# EAGLE design ESP_L6470 (EAGLE 8.6.0)
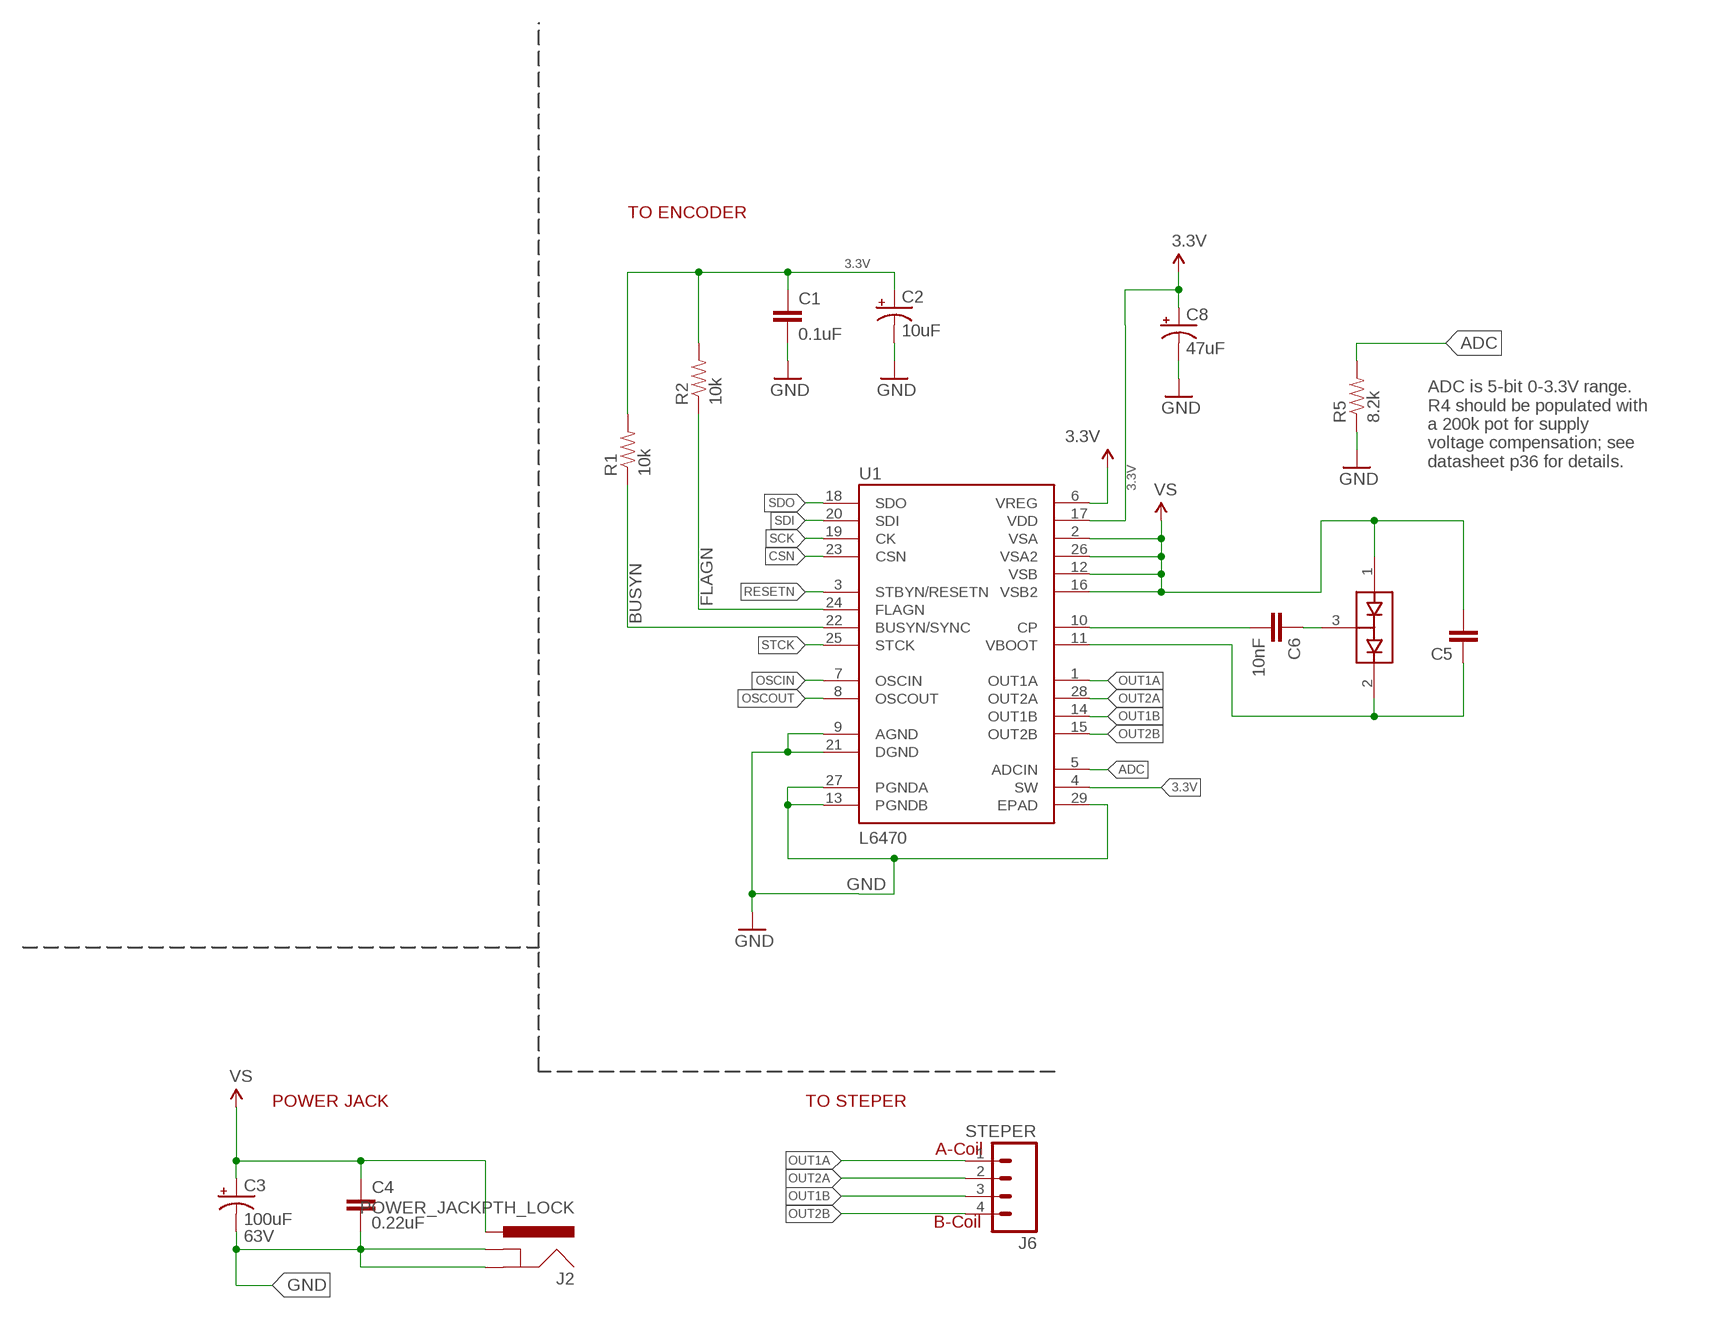
[diagram p0: schematic, sheet 1, part 1 of 2]
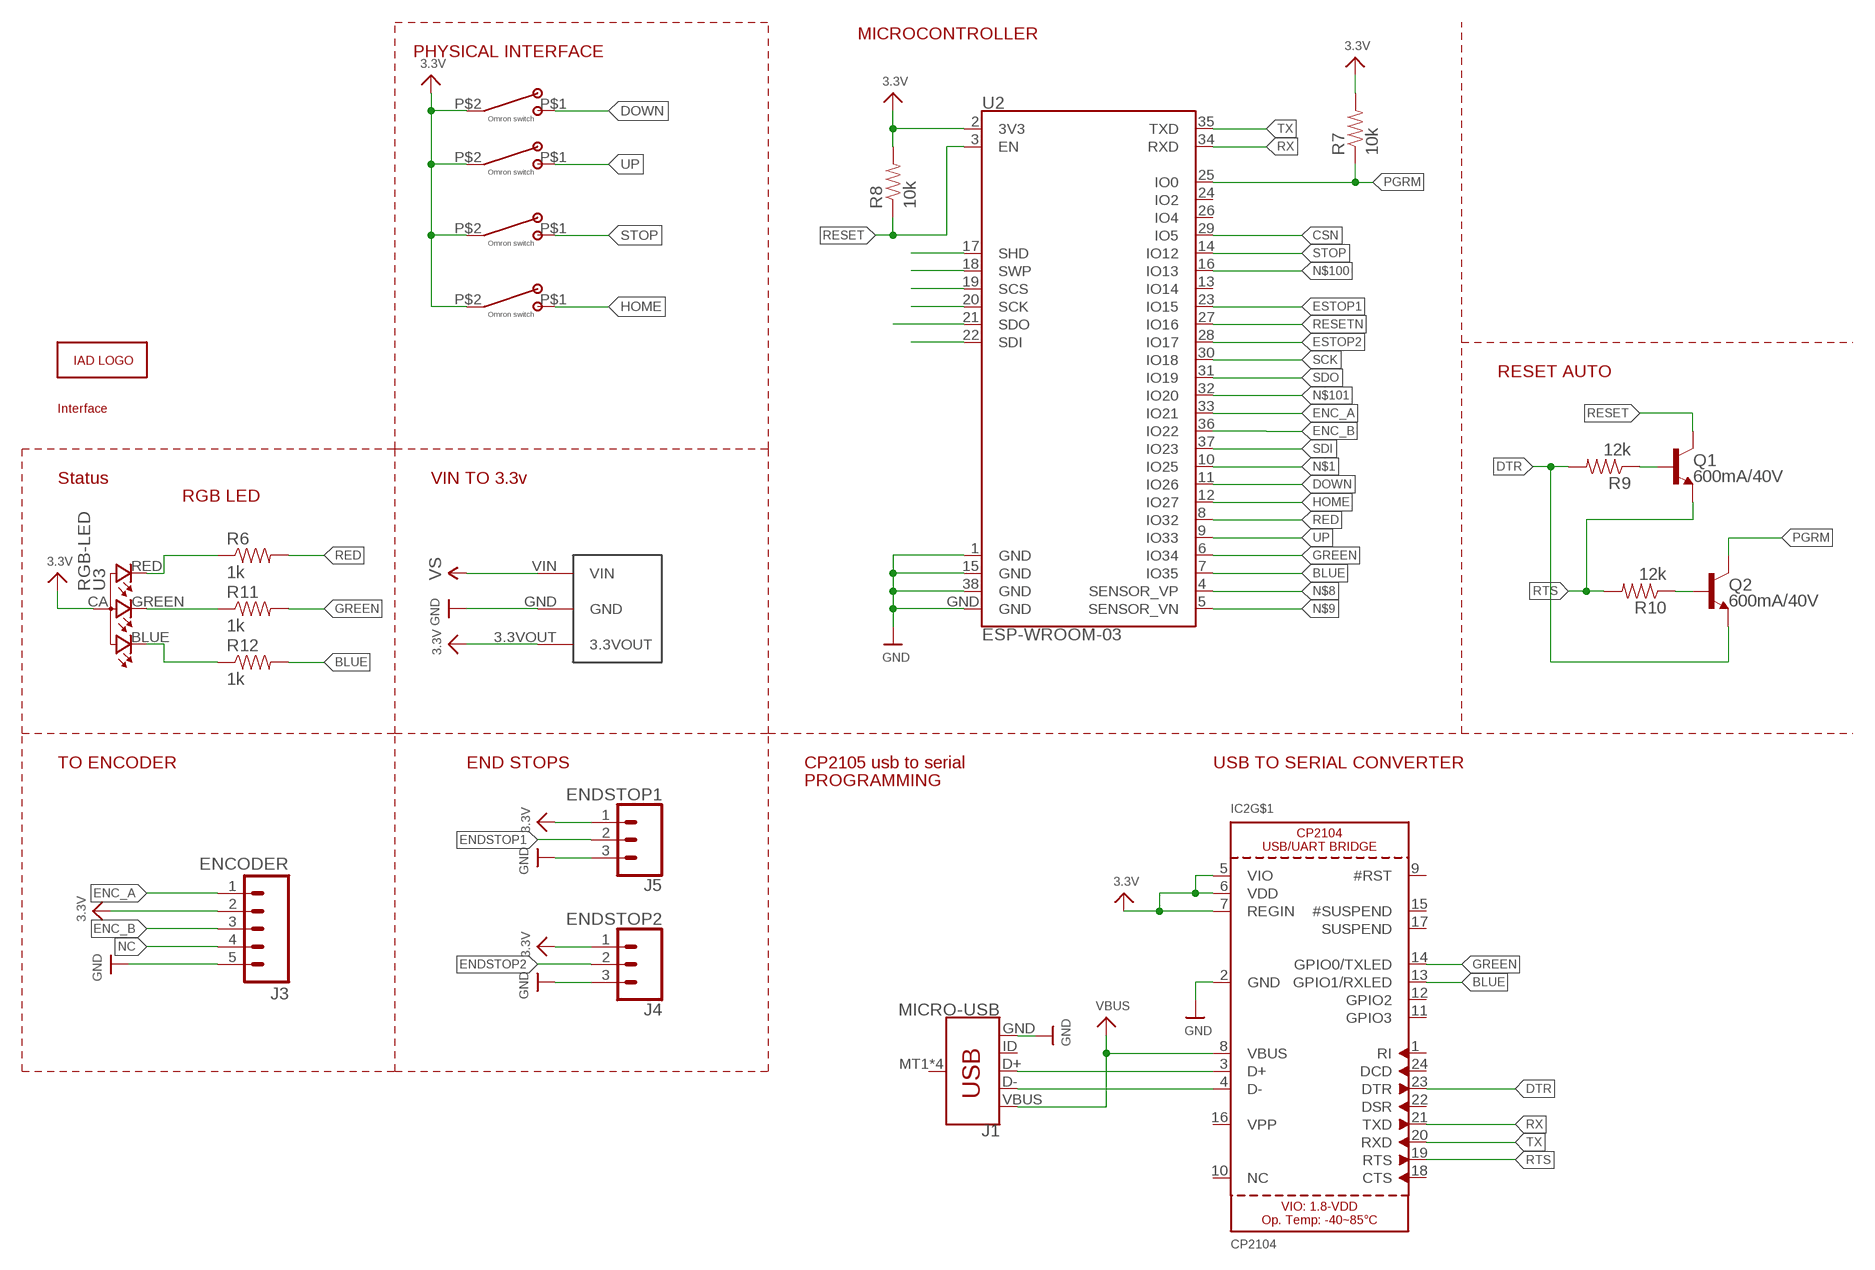
[diagram p1: schematic, sheet 1, part 2 of 2]

## Parts
A1  ZHDK_LOGO_METAL  [ZHDK_LOGO]
A2  INTERFACE_NETSTEPPER  [INTERFACE_NETSTEPPER]
C1  0.1uF  CAP0603-CAP  [0603-CAP]
C2  10uF  10UF-TANT  [EIA3216]
C3  100uF  100UF-63V-20%(ELECT)  [NIC_10X10.5_CAP]
C4  0.22uF  CAP0603-CAP  [0603-CAP]
C5  0.22uF  CAP0603-CAP  [0603-CAP]
C6  10nF  10NF/10000PF-50V-10%(0603)  [0603-CAP]
C8  47uF  47UF-TANT  [EIA3528]
D1  BAV99  [SOT23-3@1]
IC2  CP2104  [QFN24_4MM_SMSC]
J1  MICRO-USB  USB_MICRO-B_SMT  [USB-MICROB]
J2  POWER_JACKPTH_LOCK  [POWER_JACK_PTH_LOCK]
J3  ENCODER  M05PTH  [1X05]
J4  ENDSTOP2  CONN_03  [1X03]
J5  ENDSTOP1  CONN_03  [1X03]
J6  STEPER  M04LOCK_LONGPADS  [1X04_LOCK_LONGPADS]
Q1  600mA/40V  TRANS_NPN-MMBT2222AL  [SOT23-3]
Q2  600mA/40V  TRANS_NPN-MMBT2222AL  [SOT23-3]
R1  10k  RESISTOR0603-RES  [0603-RES]
R2  10k  RESISTOR0603-RES  [0603-RES]
R5  8.2k  RESISTOR0603-RES  [0603-RES]
R6  1k  RESISTOR0603-RES  [0603-RES]
R7  10k  RESISTOR0603-RES  [0603-RES]
R8  10k  RESISTOR0603-RES  [0603-RES]
R9  12k  RESISTOR0603-RES  [0603-RES]
R10  12k  RESISTOR0603-RES  [0603-RES]
R11  1k  RESISTOR0603-RES  [0603-RES]
R12  1k  RESISTOR0603-RES  [0603-RES]
S1  B3AL-1002P-MS  [B3AL-1002P-MS]
S2  B3AL-1002P-MS  [B3AL-1002P-MS]
S3  B3AL-1002P-MS  [B3AL-1002P-MS]
S4  B3AL-1002P-MS  [B3AL-1002P-MS]
U1  L6470  L6470  [HTSSOP28]
U2  ESP-WROOM-03  [ESP-WROOM-03]
U3  RGB-LED  RGB-LED-CLMVB-FKARGB  [PLCC4-2MM-RGB]
U4  TRACO12433  [TRACO12433]

## Nets
3.3V: C1.1 C2.A(+) C8.A(+) IC2.5(VIO) IC2.6(VDD) IC2.7(REGIN) J3.2 J4.1 J5.1 R1.2 R2.2 R7.2 R8.2 S1.P$2 S2.P$2 S3.P$2 S4.P$2 U1.4(SW) U1.6(VREG) U1.17(VDD) U2.2(3V3) U3.CA U4.3.3VOUT
ADC: R5.2 U1.5(ADCIN)
BLUE: IC2.13(GPIO1/RXLED) R12.2 U2.7(IO35)
BUSYN: R1.1 U1.22(BUSYN/SYNC)
CP_HIGH: C6.1 D1.3(COM)
CSN: U1.23(CSN) U2.29(IO5)
DOWN: S1.P$1 U2.11(IO26)
DTR: IC2.23(DTR) Q2.2(E) R9.2
ENC_A: J3.1 U2.33(IO21)
ENC_B: J3.3 U2.36(IO22)
ENDSTOP1: J5.2
ENDSTOP2: J4.2
ESTOP1: U2.23(IO15)
ESTOP2: U2.28(IO17)
FLAGN: R2.1 U1.24(FLAGN)
GND: C1.2 C2.C(-) C3.- C4.2 C8.C(-) IC2.2(GND) J1.GND J2.GND J2.GNDBREAK J3.5 J4.3 J5.3 R5.1 U1.9(AGND) U1.13(PGNDB) U1.21(DGND) U1.27(PGNDA) U1.29(EPAD) U2.1(GND) U2.15(GND) U2.38(GND) U2.GND U4.GND
GREEN: IC2.14(GPIO0/TXLED) R11.2 U2.6(IO34)
HOME: S4.P$1 U2.12(IO27)
N$1: U2.10(IO25)
N$2: U2.17(SHD)
N$3: U2.18(SWP)
N$4: U2.19(SCS)
N$5: U2.20(SCK)
N$6: U2.21(SDO)
N$8: U2.4(SENSOR_VP)
N$9: U2.5(SENSOR_VN)
N$10: U2.22(SDI)
N$11: R11.1 U3.GREEN
N$12: R6.1 U3.RED
N$13: IC2.3(D+) J1.D+
N$14: IC2.4(D-) J1.D-
N$20: R12.1 U3.BLUE
N$22: Q1.1(B) R9.1
N$23: Q2.1(B) R10.1
N$100: U2.16(IO13)
N$101: U2.32(IO20)
NC: J3.4
OSCIN: U1.7(OSCIN)
OSCOUT: U1.8(OSCOUT)
OUT1A: J6.1 U1.1(OUT1A)
OUT1B: J6.3 U1.14(OUT1B)
OUT2A: J6.2 U1.28(OUT2A)
OUT2B: J6.4 U1.15(OUT2B)
PGRM: Q2.3(C) R7.1 U2.25(IO0)
RED: R6.2 U2.8(IO32)
RESET: Q1.3(C) R8.1 U2.3(EN)
RESETN: U1.3(STBYN/RESETN) U2.27(IO16)
RTS: IC2.19(RTS) Q1.2(E) R10.2
RX: IC2.21(TXD) U2.34(RXD)
SCK: U1.19(CK) U2.30(IO18)
SDI: U1.20(SDI) U2.37(IO23)
SDO: U1.18(SDO) U2.31(IO19)
STCK: U1.25(STCK)
STOP: S3.P$1 U2.14(IO12)
TX: IC2.20(RXD) U2.35(TXD)
UP: S2.P$1 U2.9(IO33)
V_BOOT: C5.1 D1.2(C2) U1.11(VBOOT)
V_CP: C6.2 U1.10(CP)
VBUS: IC2.8(VBUS) J1.VBUS
VS: C3.+ C4.1 C5.2 D1.1(A1) J2.PWR U1.2(VSA) U1.12(VSB) U1.16(VSB2) U1.26(VSA2) U4.VIN
Unconnected: IC2.1(RI) IC2.9(#RST) IC2.10(NC) IC2.11(GPIO3) IC2.12(GPIO2) IC2.15(#SUSPEND) IC2.16(VPP) IC2.17(SUSPEND) IC2.18(CTS) IC2.22(DSR) IC2.24(DCD) J1.ID J1.MT1(SHIELD) J1.MT2(SHIELD) J1.P$1(SHIELD) J1.P$2(SHIELD) U2.13(IO14) U2.24(IO2) U2.26(IO4)

## Notes on the sheet
- MICROCONTROLLER
- PHYSICAL INTERFACE
- TO ENCODER
- RESET AUTO
- ADC is 5-bit 0-3.3V range.
  R4 should be populated with
  a 200k pot for supply
  voltage compensation; see
  datasheet p36 for details.
- Status | VIN TO 3.3v
- RGB LED
- TO ENCODER | END STOPS | CP2105 usb to serial | USB TO SERIAL CONVERTER
- PROGRAMMING
- POWER JACK | TO STEPER
- A-Coil
- B-Coil
- 63V

## Power pins joined to a net without a drawn wire
TP: IC2.THERM(TP)

## Library data of the parts
A1 = IAD_GRAPHIC:ZHDK_LOGO_METAL
A2 = IAD_GRAPHIC:INTERFACE_NETSTEPPER
C1 C4 C5 = SparkFun-Passives:CAP: Capacitor Standard 0603 ceramic capacitor, and 0.1" leaded capacitor.
C2 = SparkFun-Capacitors:10UF-TANT: 10uF Tantalum SMT CAP-00811- 16V 10% (EIA-3216); PROD_ID: CAP-00811
C3 = SparkFun-Capacitors:100UF-63V-20%(ELECT): CAP-08362 100uF electrolytic SMT 63V 20%; PROD_ID: CAP-08362
C6 = SparkFun-Capacitors:10NF/10000PF-50V-10%(0603): CAP-00867; PROD_ID: CAP-00867
C8 = SparkFun-Capacitors:47UF-TANT: 47uF Tantalum SMT CAP-08310- 10V 10% (EIA-3528); PROD_ID: CAP-08310
D1 = SparkFun-DiscreteSemi:BAV99: Two small signal silicon diodes connected anode to cathode. Connections to all three nodes available. DIO-10647; PROD_ID: DIO-10647
IC2 = microbuilder:CP2104: CP2104 - USB to UART Bridge VDD Output: 3.45V
J1 = SparkFun-Connectors:USB_MICRO-B: USB Type Micro-B Connector Male/female and PTH/SMT variants SparkFun Products: SparkFun microB USB Breakout <https://www.sparkfun.com/products/12035> SparkFun USB microB Plug Breakout <https://www.sparkfun.com/products/10031> SparkFun ESP8266 Thing <https://www.sparkfun.com/products/13231>; PROD_ID: CONN-09505; SF_ID: PRT-08533
J2 = SparkFun-Connectors:POWER_JACK: Power Jack This is the standard 5.5mm barrel jack for power. The PTH is the most common, proven, reliable, footprint. The Slot footprint only works if the mill layer is transmitted to the PCB fab house so be warned. Mating wall wart : TOL-00298 (and others); PROD_ID: CONN-08197; SF_ID: PRT-00119
J3 = SparkFun-Connectors:M05: Header 5 Standard 5-pin 0.1" header. Use with straight break away headers (SKU : PRT-00116), right angle break away headers (PRT-00553), swiss pins (PRT-00743), machine pins (PRT-00117), and female headers (PRT-00115). Molex polarized connector foot print use with SKU : PRT-08230 with associated crimp pins and housings.
J4 J5 = SparkFun-Connectors:CONN_03: Multi connection point. Often used as Generic Header-pin footprint for 0.1 inch spaced/style header connections On any of the 0.1 inch spaced packages, you can populate with these: Break Away Headers - Straight <https://www.sparkfun.com/products/116> (PRT-00116) Break Away Male Headers - Right Angle <https://www.sparkfun.com/products/553> (PRT-00553) Female Headers <https://www.sparkfun.com/products/115> (PRT-00115) Break Away Headers - Machine Pin <https://www.sparkfun.com/products/117> (PRT-00117) Break Away Female Headers - Swiss Machine Pin <https://www.sparkfun.com/products/743> (PRT-00743) Stackable Header - 3 Pin (Female, 0.1") <https://www.sparkfun.com/products/13875> (PRT-13875) For SCREWTERMINALS and SPRING TERMINALS visit here: Screw Terimnals on SparkFun.com <https://www.sparkfun.com/search/results?term=Screw+Terminals> (5mm/3.5mm/2.54mm spacing) This device is also useful as a general connection point to wire up your design to another part of your project. Our various solder wires solder well into these plated through hole pads. Hook-Up Wire - Assortment (Stranded, 22 AWG) <https://www.sparkfun.com/products/11375> (PRT-11375) Hook-Up Wire - Assortment (Solid Core, 22 AWG) <https://www.sparkfun.com/products/11367> (PRT-11367) View the entire wire category on our website here <https://www.sparkfun.com/categories/141> Special notes: Molex polarized connector foot print use with SKU : PRT-08232 with associated crimp pins and housings.
J6 = SparkFun-Connectors:M04: Header 4 Standard 4-pin 0.1" header. Use with straight break away headers (SKU : PRT-00116), right angle break away headers (PRT-00553), swiss pins (PRT-00743), machine pins (PRT-00117), and female headers (PRT-00115). Molex polarized connector foot print use with SKU : PRT-08231 with associated crimp pins and housings. 1MM SMD Version SKU: PRT-10208; PROD_ID: CONN-09696
Q1 Q2 = SparkFun-DiscreteSemi:TRANS_NPN: NPN transistor Current controlled devices typically used to amplify current or used as a switch. BC547 - COM-08928 <http://www.sparkfun.com/products/8928> (TO-92 45V 100mA) (1.Collector 2.Base 3.Emitter) 2N3904 - COM-00521 <http://www.sparkfun.com/products/521> (TO-92 40V 200mA) (1.Emitter 2.Base 3.Collector) P2N2222A - COM-12852 <http://www.sparkfun.com/products/12852> (TO-92 40V 600mA) (1.Collector 2.Base 3.Emitter); PROD_ID: TRANS-08049
R1 R2 R5-R12 = SparkFun-Passives:RESISTOR: Resistor Basic schematic elements and footprints for 0603, 1206, and PTH resistors.
S1-S4 = IAD-Library:B3AL-1002P-MS
U1 = SparkFun-PowerIC:L6470: 3A RMS/7A peak bipolar stepper motor driver with SPI control and step input in HTSSOP-28 package. IC-10648; PROD_ID: IC-10648
U2 = esp32:ESP-WROOM-03
U3 = Particle:RGB-LED-CLMVB-FKA: CREE CLMVB-FKA RGB LED 2mm x 2mm
U4 = IAD_ZHDK:TRACO12433

## Board
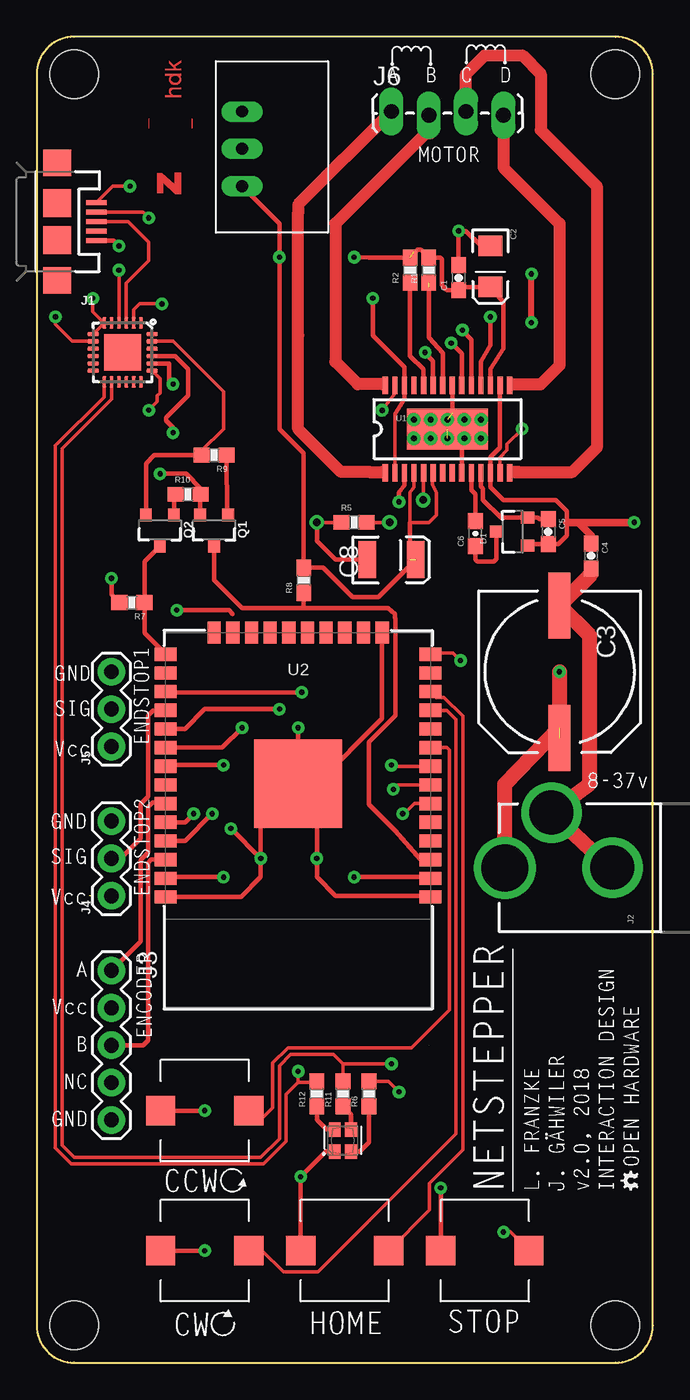
[diagram p2: board, top side]
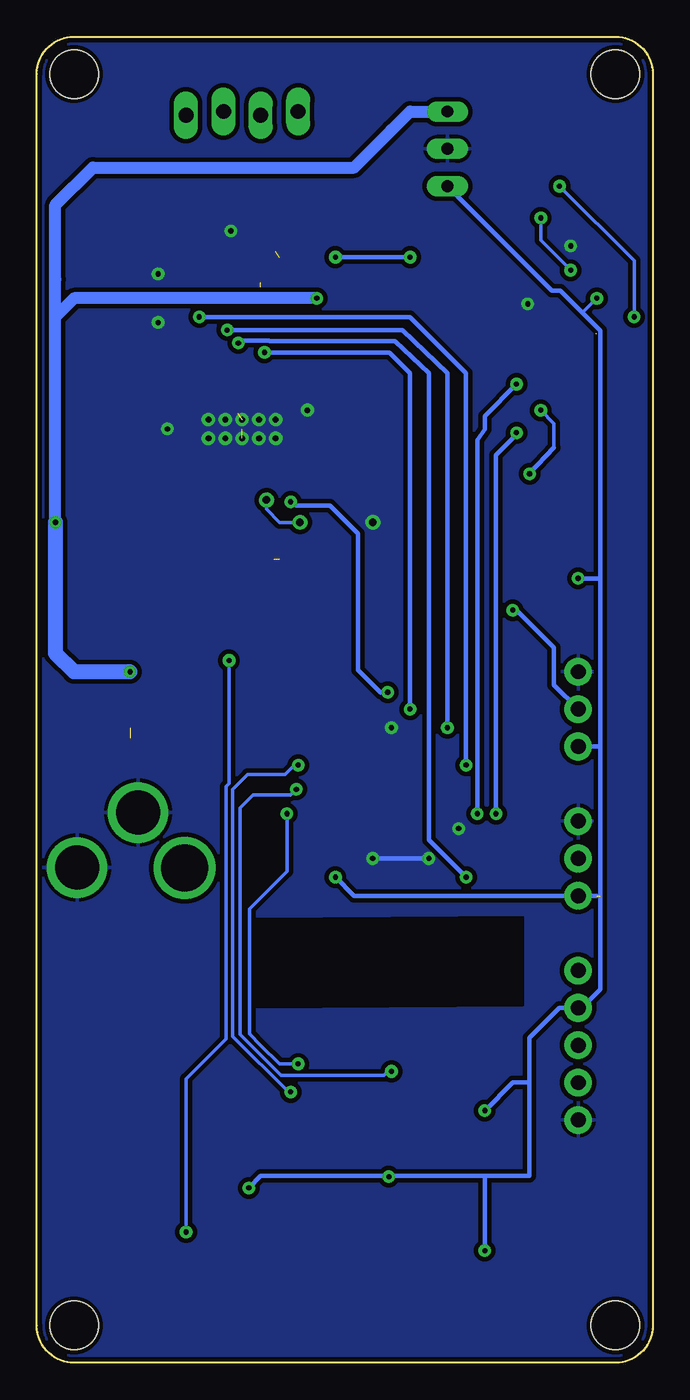
[diagram p3: board, bottom side, seen from below]

Size 41.91 x 90.17 mm. Coordinates in mm from the lower left corner, seen from the top.
Outline: 41.91,2.54 41.91,87.63 arc90 39.37,90.17 2.54,90.17 arc90 0,87.63 0,2.54 arc90 2.54,0 39.37,0 arc90 41.91,2.54
Copper layers (1*16): Top 0.035mm / dielectric 1.5mm / Bottom 0.035mm
Design rules "SparkFun *": minimum track width 8mil, minimum drill 20mil, track to track 8mil, track to pad 12mil, pad to pad 8mil, via to via 16mil, smd to smd 8mil, copper to edge 10mil, drill to drill 8mil, minimum pad ring 12mil, minimum via ring 10mil, stop-mask expansion 4mil, vias tented up to drill 25mil, thermal gap 10mil

### Footprints (pad centres in the part's own frame; a part is rotated, then mirrored left to right if it is on the bottom)
0603-CAP = smd 1.1 x 1: 1 -0.85,0; 2 0.85,0
EIA3216 = smd 1.4 x 1.6: A 1.4,0; C -1.4,0
NIC_10X10.5_CAP = smd 4.5 x 1.5: + 4.5,0; - -4.5,0
EIA3528 = smd 1.2 x 2.5: A 1.65,0; C -1.65,0
SOT23-3@1 = smd 0.8 x 0.9: 1 -0.95,-1; 2 0.95,-1; 3 0,1.1
QFN24_4MM_SMSC = smd 0.8 x 0.28: 1 -2,1.25; 2 -2,0.75; 3 -2,0.25; 4 -2,-0.25; 5 -2,-0.75; 6 -2,-1.25; 13 2,-1.25; 14 2,-0.75; 15 2,-0.25; 16 2,0.25; 17 2,0.75; 18 2,1.25 | smd 0.28 x 0.8: 7 -1.25,-2; 8 -0.75,-2; 9 -0.25,-2; 10 0.25,-2; 11 0.75,-2; 12 1.25,-2; 19 1.25,2; 20 0.75,2; 21 0.25,2; 22 -0.25,2; 23 -0.75,2; 24 -1.25,2 | smd 2.5 x 2.5: THERM 0,0
USB-MICROB = smd 1.4 x 0.35: D+ -2.65,0; D- -2.65,-0.65; GND -2.65,1.3; ID -2.65,0.65; VBUS -2.65,-1.3 | smd 1.9 x 1.8: MT1 0,-4; MT2 0,4 | smd 1.9 x 1.9: P$1 0,-1.27; P$2 0,1.27
POWER_JACK_PTH_LOCK = drill 2.997 pad 4.115: GND 0.025,6.557; GNDBREAK 3.762,10.7 | drill 3.2 pad 4.115: PWR 0,13.878
1X05 = drill 1.016 pad 1.88: 1 0,0; 2 2.54,0; 3 5.08,0; 4 7.62,0; 5 10.16,0
1X03 = drill 1.016 pad 1.88: 1 0,0; 2 2.54,0; 3 5.08,0
1X04_LOCK_LONGPADS = drill 1.016 long: 1 0,0; 2 2.54,-0.254; 3 5.08,0; 4 7.62,-0.254
SOT23-3 = smd 0.8 x 0.9: 1 -0.95,-1; 2 0.95,-1; 3 0,1.1
0603-RES = smd 1.1 x 1: 1 -0.85,0; 2 0.85,0
B3AL-1002P-MS = smd 2 x 2: P$1 -3,0; P$2 3,0
HTSSOP28 = smd 0.36 x 1.19: 1 -4.225,-2.97; 2 -3.575,-2.97; 3 -2.925,-2.97; 4 -2.275,-2.97; 5 -1.625,-2.97; 6 -0.975,-2.97; 7 -0.325,-2.97; 8 0.325,-2.97; 9 0.975,-2.97; 10 1.625,-2.97; 11 2.275,-2.97; 12 2.925,-2.97; 13 3.575,-2.97; 14 4.225,-2.97; 15 4.225,2.97; 16 3.575,2.97; 17 2.925,2.97; 18 2.275,2.97; 19 1.625,2.97; 20 0.975,2.97; 21 0.325,2.97; 22 -0.325,2.97; 23 -0.975,2.97; 24 -1.625,2.97; 25 -2.275,2.97; 26 -2.925,2.97; 27 -3.575,2.97; 28 -4.225,2.97 | smd 5.5 x 2.8: 29 0,0
ESP-WROOM-03 = smd 0.9 x 1.5: 1 7.7,9; 2 6.43,9; 3 5.16,9; 4 3.89,9; 5 2.62,9; 6 1.35,9; 7 0.08,9; 8 -1.19,9; 9 -2.46,9; 10 -3.73,9; 11 -5,9; 12 -6.27,9; 13 -7.54,9; 14 -8.81,9; 25 -8.81,-9; 26 -7.54,-9; 27 -6.27,-9; 28 -5,-9; 29 -3.73,-9; 30 -2.46,-9; 31 -1.19,-9; 32 0.08,-9; 33 1.35,-9; 34 2.62,-9; 35 3.89,-9; 36 5.16,-9; 37 6.43,-9; 38 7.7,-9 | smd 1.5 x 0.9: 15 -10.3,5.715; 16 -10.3,4.445; 17 -10.3,3.175; 18 -10.3,1.905; 19 -10.3,0.635; 20 -10.3,-0.635; 21 -10.3,-1.905; 22 -10.3,-3.175; 23 -10.3,-4.445; 24 -10.3,-5.715 | smd 6 x 6: GND 0,0
PLCC4-2MM-RGB = smd 1 x 0.8: BLUE -0.75,-0.55; CA 0.75,-0.55; GREEN -0.75,0.55; RED 0.75,0.55
TRACO12433 = drill 0.8 long: 3.3VOUT 0,-2.54; GND 0,0; VIN 0,2.54
STAND-OFF = hole 3.302: 0,0

### Placement (x,y rotation side)
A1  7.62,78.74 90 top
A2  2.54,2.54 0 top
C1  28.7,73.79 90 top
C2  30.86,74.55 270 top
C3  35.56,46.99 270 top
C4  37.72,54.86 270 top
C5  34.8,56.52 270 top
C6  29.84,56.39 90 top
C8  24.13,54.61 0 top
D1  32.38,56.52 90 top
IC2  5.84,68.71 270 top
J1  1.4,77.6 180 top
J2  45.72,33.66 90 top
J3  5.08,26.67 270 top
J4  5.08,31.75 90 top
J5  5.08,41.91 90 top
J6  24.13,85.09 0 top
Q1  12.07,56.64 180 top
Q2  8.38,56.64 180 top
R1  26.67,74.29 90 top
R2  25.4,74.29 90 top
R5  21.59,57.15 0 top
R6  22.61,18.29 90 top
R7  6.48,51.69 180 top
R8  18.16,53.21 90 top
R9  12.07,61.72 180 top
R10  10.29,59.05 0 top
R11  20.83,18.29 90 top
R12  19.05,18.29 90 top
S1  11.43,7.62 180 top
S2  11.43,17.14 180 top
S3  30.48,7.62 180 top
S4  20.96,7.62 180 top
U1  27.94,63.5 0 top
U2  17.78,39.37 270 top
U3  20.83,15.11 270 top
U4  13.97,82.55 0 top
U$9  [STAND-OFF]  2.54,2.54 0 top
U$10  [STAND-OFF]  39.37,2.54 0 top
U$11  [STAND-OFF]  39.37,87.63 0 top
U$12  [STAND-OFF]  2.54,87.63 0 top

### Tracks (layer width: path | path; a pad name or v marks a point on that pad's centre or on a via)
3.3V  (via drill 0.35)  (4 unrouted)
  Top 0.254: U1.4 25.66,59.95 25.65,59.56 25.4,59.18 25.4,57.15 26.67,57.15 27.18,57.66 27.18,59.18 26.92,59.73 U1.6 | C2.A | 28.91,73.15 C1.1 | IC2.5 IC2.6 | IC2.6 3.91,70.03 3.84,70.03 | IC2.6 3.81,71.49 v3.81,72.39
  Top 0.305: U1.17 30.86,67.56 31.75,68.96 31.75,72.14 C2.A | C2.A 28.91,73.15 | C1.1 27.9,72.94 27.56,73.28 27.56,75.06 27.47,75.14 R1.2 26.12,75.69 25.91,75.69 25.78,75.56 25.65,75.56 | 25.4,57.15 25.4,54.61 | U4.3.3VOUT 16.51,77.47 v16.51,75.18 16.51,63.5 18.16,61.85 R8.2 19.47,54.06 21.46,52.07 23.24,52.07 C8.A | R2.2 22.57,75.14 v21.59,75.18 | S3.P$2 v27.48,11.89 | S4.P$2 v17.96,12.65 19.67,14.36 U3.CA 20.32,14.32 | U2.2 26.7,33.02 v21.59,33.02 | R7.2 5.08,52.24 v5.08,53.34 | S1.P$2 v11.43,7.62 | S2.P$2 v11.43,17.14
  Bottom 0.254: v3.81,72.39 4.78,71.42 | 19.05,12.7 18,12.7 v17.96,12.65
  Bottom 0.305: v21.59,75.18 v16.51,75.18 | J5.1 3.56,41.91 | 3.56,41.91 3.56,31.75 3.56,25.4 4.83,24.13 J3.2 6.35,24.13 8.38,22.1 8.38,19.05 | 3.81,31.75 J4.1 6.35,31.75 20.32,31.75 v21.59,33.02 | 3.56,41.91 3.56,48.77 3.56,53.34 | 3.56,53.34 3.56,54.61 3.56,58.42 3.56,63.5 3.56,70.2 4.78,71.42 6.28,72.92 6.88,72.92 U4.3.3VOUT | v27.48,11.89 26.67,12.7 19.05,12.7 11.43,12.7 | 11.43,12.7 8.38,12.7 8.38,16.51 8.38,19.05 | v5.08,53.34 3.56,53.34 | v11.43,7.62 11.43,12.7 | v11.43,17.14 9.53,19.05 8.38,19.05
ADC  (via drill 0.51)
  Top 0.254: U1.5 26.29,60.5 26.29,58.8 v26.29,58.67 | v24,57.15 23.37,57.15 R5.2
  Bottom 0.254: v26.29,58.67 26.29,58.04 25.4,57.15 v24,57.15
BLUE  (via drill 0.35)
  Top 0.254: IC2.13 4.59,65.68 1.27,62.36 1.27,14.61 1.51,14.35 2.35,13.51 15.43,13.51 16.97,15.05 16.97,18.24 17.78,19.05 | 17.78,19.05 18.96,19.05 R12.2 | U2.7 24.56,39.29 v24.26,38.99 | v17.78,19.81 17.78,19.05
  Bottom 0.254: v24.26,38.99 24.64,38.61 27.18,38.61 28.07,37.72 28.07,22.34 25.29,19.56 18.29,19.56 17.78,20.07 v17.78,19.81
BUSYN  (1 unrouted)
  Top 0.203: 26.67,73.15 26.67,73.02
  Top 0.305: U1.22 27.62,68.65 26.67,69.72 26.67,71.12 26.67,73.15
CP_HIGH
  Top 0.305: D1.3 31.29,54.65 31.11,54.48 29.97,54.48 29.84,54.61 C6.1
CSN  (via drill 0.35)
  Top 0.305: U1.23 26.96,68.11 v26.42,68.71 | U2.29 10.08,43.1 11.43,44.45 v16.51,44.45
  Bottom 0.305: v26.42,68.71 17.91,68.71 16.51,67.31 v16.51,44.45
DOWN
  Top 0.254: U2.11 27.89,44.37 28.52,43.74 28.52,15.58 19.13,6.19 16.78,6.19 15.34,7.62 S1.P$1
  Top 0.305: U2.11 26.86,44.45
DTR
  Top 0.254: IC2.23 9.28,69.46 12.7,66.04 12.7,63.5 11.21,62.02 R9.2
  Top 0.305: R9.2 8,61.72 7.43,61.15 Q2.2
ENC_A
  Top 0.305: J3.1 7.07,28.66 7.07,34.2 7.57,34.71 7.57,37.8 7.87,38.1 8.7,38.1 U2.33
ENC_B
  Top 0.305: U2.36 7.79,34.21 7.57,33.99 7.57,21.92 7.24,21.59 J3.3
ENDSTOP1  (via drill 0.35)
  Top 0.305: 13.34,50.93 13.08,51.18 10.16,51.18 v9.53,51.18
  Bottom 0.305: v9.53,51.18 9.27,51.18 6.73,48.64 6.73,46.1 J5.2
ENDSTOP2
  Top 0.305: 5.16,34.21 J4.2 5.71,34.29 7.07,35.64 7.07,38.01 7.57,38.52 7.57,44.02 7.92,44.37
FLAGN
  Top 0.152: 26.29,66.5 U1.24
  Top 0.305: R2.1 25.4,72.14 25.4,68.45 26.29,67.56 26.29,66.5
GND  (via drill 0.35, 0.38, 0.4, 0.51)  (2 unrouted)
  Top 0.254: R5.1 v19.05,57.15 | U1.27 24.37,65.89 v23.5,64.77 | IC2.2 6.59,71.62 6.99,72.01 v8.51,72.01 | U1.13 31.51,61.57 32,62.05 32,62.48 v33.02,63.5 | 30.6,75.69 C2.C 30.6,75.69
  Top 0.305: U2.1 26.7,31.75 20.32,31.75 19.05,33.02 v19.05,34.29 19.05,36.83 | U2.38 13.89,31.67 15.24,33.02 v15.24,34.29 | v15.24,34.29 15.24,39.37 | v17.78,43.18 U2.GND 19.05,39.37 23.5,43.81 U2.15 | C8.C 20.32,54.61 19.05,55.88 v19.05,57.15 | C2.C 30.22,75.95 29.21,76.96 v28.7,76.96 28.7,76.2 C1.2 | U1.21 28.27,64.59 | U1.9 28.91,62.82 v29.08,62.87 | J1.GND 5.24,76.3 v5.59,75.95 | v15.24,34.29 v13.21,36.32
  Top 0.406: v33.65,70.74 v33.65,74.04
  Top 1.016: J2.GND 38.76,33.93 J2.GNDBREAK 37.61,39.37 37.61,49.44 C3.- 37.72,53.65 C4.2
  Bottom 0.305: v15.24,34.29 v19.05,34.29
  other vias: 25.65,62.87 25.65,64.13 26.8,62.87 26.8,64.13 27.94,62.87 30.23,64.13 30.23,62.87 29.08,64.13 27.94,64.13
  pour Bottom (isolate 0.305, rank 3): -1.27,-1.27 8.64,-1.27 8.64,30.48 27.05,30.35 27.05,24 8.76,24.13 8.89,-1.27 43.18,-1.27 43.18,91.44 -1.27,91.44
  pour Bottom (isolate 0.305): 34.29,59.69 21.59,59.69 21.59,67.31 34.29,67.31
GREEN  (via drill 0.35)  (1 unrouted)
  Top 0.254: IC2.14 5.08,66.69 5.08,65.52 1.73,62.17 1.73,15.24 1.73,14.78 2.54,13.97 15.24,13.97 16.51,15.24 16.51,20.19 17.27,20.96 20.19,20.96 20.83,20.32 | R11.2 20.83,20.32 | U2.6 25.7,38.02 24.89,37.21 v24.89,37.34 | v24.13,20.32 20.83,20.32
  Bottom 0.254: v24.89,37.34 24.89,33.4 27.43,30.86 27.43,22.35 26.67,21.59 25.4,20.32 v24.13,20.32
HOME
  Top 0.254: U2.12 27.17,45.25 27.71,45.25 28.98,43.98 28.98,14.46 26.72,12.2 26.72,10.39 S4.P$1
N$11
  Top 0.305: R11.1 21.38,16.89 U3.GREEN
N$12
  Top 0.305: R6.1 22.61,14.99 21.97,14.35 21.96,14.36 U3.RED
N$13
  Top 0.254: IC2.3 6.09,73.4 7.62,74.93 7.62,76.2 6.22,77.6 J1.D+
N$14  (via drill 0.35)
  Top 0.254: IC2.4 5.59,74.16 5.59,74.17 v5.59,74.29 | J1.D- 7.22,78.25 v7.62,77.85
  Bottom 0.254: v5.59,74.29 7.62,76.33 v7.62,77.85
N$20
  Top 0.305: R12.1 19.05,16.51 19.7,15.86 U3.BLUE
N$22
  Top 0.305: R9.1 12.96,57.69 Q1.1
N$23
  Top 0.305: Q2.1 9.33,59
  Top 0.406: 9.33,59 R10.1
OUT1A
  Top 0.254: 22.66,60.53 22.61,60.58
  Top 0.305: 23.5,60.58 23.54,60.66 U1.1
  Top 0.813: J6.1 17.78,78.74 17.78,78.23 17.78,69.85 17.78,63.5 20.7,60.58 22.61,60.58 23.5,60.58
OUT1B
  Top 0.305: U1.14 32.47,60.58
  Top 0.508: 32.47,60.58 32.77,60.58
  Top 0.813: J6.3 29.21,87.63 30.48,88.9 33.02,88.9 34.29,87.63 34.29,83.82 35.56,82.55 38.1,80.01 38.1,62.23 36.45,60.58 32.47,60.58 32.77,60.58
OUT2A
  Top 0.305: U1.28 23.64,66.55 23.5,66.55
  Top 0.813: 26.67,83.82 20.32,77.47 20.32,68.07 21.84,66.55 23.5,66.55
  Top 1.27: J6.2 26.67,83.82
OUT2B
  Top 0.305: U1.15 32.37,66.55
  Top 0.813: J6.4 31.75,81.28 35.56,77.47 35.56,67.82 34.29,66.55 32.77,66.55 32.37,66.55
PGRM
  Top 0.305: U2.25 7.33,49.63 R7.1 7.33,54.49 Q2.3
RED  (via drill 0.35)
  Top 0.254: U2.8 24.43,40.56 24.38,40.51 24.26,40.64 v24.13,40.64 | v24.64,18.41 23.91,19.14 R6.2
  Top 0.305: U2.8 26.7,40.64
  Bottom 0.254: v24.13,40.64 24.38,40.64 25.02,40.01 27.56,40.01 28.57,38.99 28.57,22.2 24.79,18.41 v24.64,18.41
RESET
  Top 0.305: 18.16,51.31 13.97,51.31 12.07,53.21 Q1.3 | 18.16,51.31 23.88,51.31 24.38,50.93 24.38,50.63 24.4,50.61 24.4,44 22.61,42.21 22.61,37.97 24.38,36.2 26.12,34.21 U2.3 | 18.16,51.31 R8.1
RESETN  (via drill 0.35)
  Top 0.305: U1.3 25.02,59.94 25.02,59.69 24.64,59.18 v24.64,58.55 | U2.27 8.89,45.64 | 8.89,45.64 9.1,45.64 | v18.03,45.59 8.94,45.59 8.89,45.64
  Bottom 0.305: v24.64,58.55 24.26,58.29 21.97,58.29 20.07,56.39 20.07,47.12 18.54,45.59 v18.03,45.59
RTS  (via drill 0.35)
  Top 0.254: IC2.19 8.38,66.92 8.38,65.95 8.2,65.77 8.2,65.35 v7.62,64.77
  Top 0.305: 11.12,58.98 Q1.2 | R10.2 11.19,59.43 10.16,60.45 v8.38,60.45
  Top 0.406: R10.2 11.12,58.98
  Bottom 0.254: 6.73,62.23 6.73,63.88 v7.62,64.77
  Bottom 0.305: v8.38,60.45 6.73,62.23
RX  (via drill 0.35)
  Top 0.305: U2.34 10.08,36.75 v10.67,37.34 | v9.27,63.25 9.27,63.58 8.79,64.06 8.79,64.26 10.29,65.76 10.29,67.56 9.4,68.45 8.49,68.45 | 8.49,68.45 8.49,68.46 | IC2.21 8.49,68.45
  Bottom 0.305: v10.67,37.34 10.67,61.72 9.27,63.12 v9.27,63.25
SCK  (via drill 0.35)
  Top 0.305: U1.19 29.57,69.57 v28.96,70.23 | U2.30 12.62,41.83 v13.97,43.18
  Bottom 0.305: v28.96,70.23 17.02,70.23 13.97,67.31 v13.97,43.18
SDI  (via drill 0.35)
  Top 0.305: U2.37 8.86,33.02 v12.7,33.02 | U1.20 28.91,68.62 v28.19,69.34
  Bottom 0.305: v12.7,33.02 15.24,35.56 15.24,67.31 17.53,69.47 26.07,69.47 26.09,69.49 28.04,69.49 v28.19,69.34
SDO  (via drill 0.35)
  Top 0.305: v30.86,71.12 30.86,69.21 30.23,68.07 30.21,68.06 U1.18 | U2.31 8.86,40.64 v12.7,40.64
  Bottom 0.305: v30.86,71.12 30.1,71.12 16.51,71.12 12.7,67.31 12.7,41.91 v12.7,40.64
STOP  (via drill 0.35)
  Top 0.254: 26.86,48.26 28.32,48.26 v28.83,47.75 | v31.75,8.89 32.21,8.89 S3.P$1
  Top 0.305: U2.14 26.86,48.26 U2.14
  Bottom 0.254: v28.83,47.75 28.83,39.38 29.03,39.18 29.03,22.01 31.75,19.3 v31.75,8.89
TX  (via drill 0.35)
  Top 0.305: U2.35 10.08,35.48 v11.94,37.34 | IC2.20 7.85,67.94 9.02,67.94 9.02,66.8 v9.27,66.55
  Bottom 0.305: v11.94,37.34 11.94,62.74 11.43,63.5 11.43,64.39 v9.27,66.55
UP
  Top 0.254: U2.9 27.89,41.83 28.07,41.66 28.07,29.21 | 28.07,29.21 28.07,28.83 | 28.07,29.21 28.07,24 25.48,21.41 17.08,21.41 16.05,20.38 16.05,17.32 15.24,16.51 15.07,16.51 S2.P$1
  Top 0.305: U2.9 26.86,41.91
V_BOOT
  Top 0.305: U1.11 30.21,59.57 30.35,59.44 30.35,58.67 31.56,57.47 D1.2 34.1,57.47 34.2,57.37 C5.1
V_CP
  Top 0.305: U1.10 29.57,59.34 29.84,59.05 C6.2
VBUS  (via drill 0.35)
  Top 0.254: J1.VBUS 5.16,80.01 v6.35,80.01 | IC2.8 2.42,69.46 1.27,70.61 v1.27,71.12
  Bottom 0.254: v6.35,80.01 1.27,74.93 v1.27,71.12
VS  (via drill 0.35)  (1 unrouted)
  Top 0.254: U1.2 24.37,64.5 24.77,65.15 | 25.02,65.91 U1.26
  Top 0.305: 24.77,65.15 25.02,65.53 25.02,65.91 | D1.1 33.48,55.66 C5.2 35.47,55.66 36.07,56.26 36.07,57.15 36.07,57.91 35.31,58.67 31.75,58.67 30.86,59.56 U1.12 30.86,61.59 30.86,61.6 31.51,62.25 U1.16 | U1.26 25.02,67.69 22.86,69.85 v22.86,72.39
  Top 0.508: v40.64,57.15 36.83,57.15 | 36.83,57.15 36.07,57.15 | C4.1 37.72,56.26 36.83,57.15
  Top 1.016: J2.PWR 31.84,39.34 35.56,43.18 | v35.56,46.99 C3.+
  Bottom 0.813: v40.64,57.15 40.64,71.12 | 40.64,71.12 40.64,73.66 40.64,78.74 38.1,81.28 20.32,81.28 17.78,83.82 16.51,85.09 U4.VIN | v22.86,72.39 39.37,72.39 40.64,71.12
  Bottom 1.016: v40.64,57.15 40.64,48.26 39.37,46.99 v35.56,46.99